# Altium project HallSensor.PrjPCB
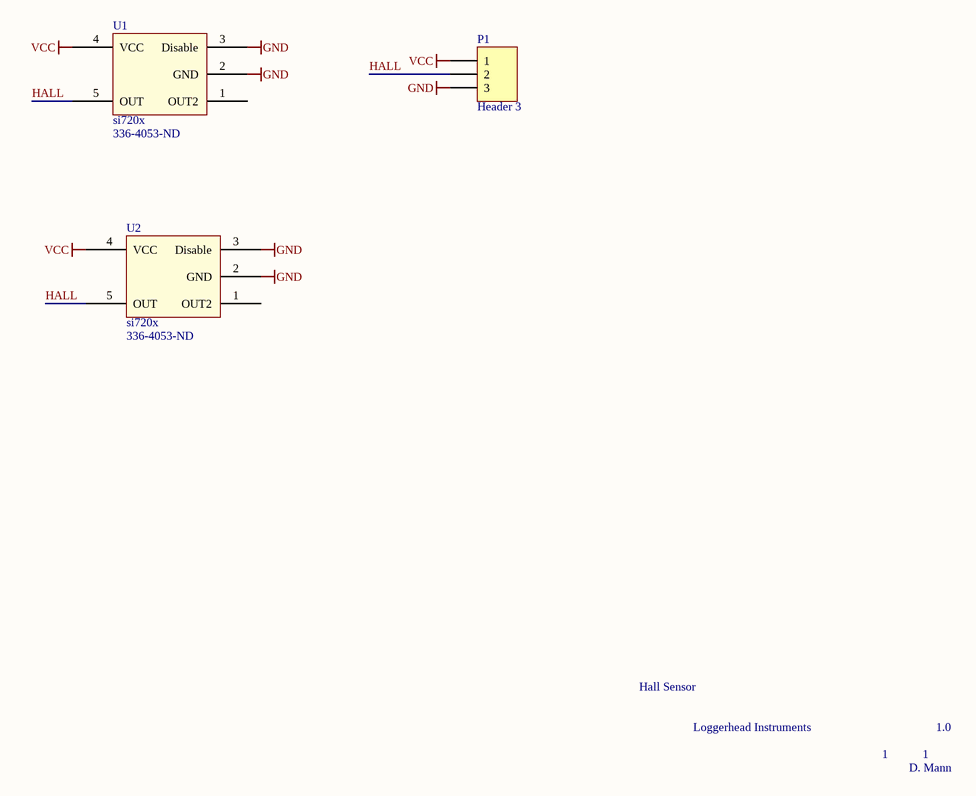
[diagram p0: HallSensor.SchDoc]
1 sheet, 3 parts. Net scope: global (net labels, ports and power ports of the same name join across sheets).
Board file: HallSensor.PcbDoc

## Sheet HallSensor.SchDoc
size A

### Parts
P1  Header 3  [HDR1X3]
U1  si720x  Supplier Part Number 1: 336-4053-ND  [Hall_si720x]
U2  si720x  Supplier Part Number 1: 336-4053-ND  [Hall_si720x]

### Nets
GND: P1.3 U1.2(GND) U1.3(Disable) U2.2(GND) U2.3(Disable)
VCC: P1.1 U1.4(VCC) U2.4(VCC)
HALL: P1.2 U1.5(OUT) U2.5(OUT)

Not connected (* = marked no-connect by the designer): U1 1(OUT2); U2 1(OUT2)

### Notes on the sheet
- Hall Sensor
- Loggerhead Instruments
- 1
- 1.0
- D. Mann

### Library data of the parts
P1 = Header 3: Header, 3-Pin; LatestRevisionDate: 17-Jul-2002; LatestRevisionNote: Re-released for DXP Platform.; Publisher: Altium Limited
U1 U2 = Hall_si720x: Hall Sensor; Supplier 1: Digi-Key